# EAGLE design botboardpro-mini (EAGLE 4.16)
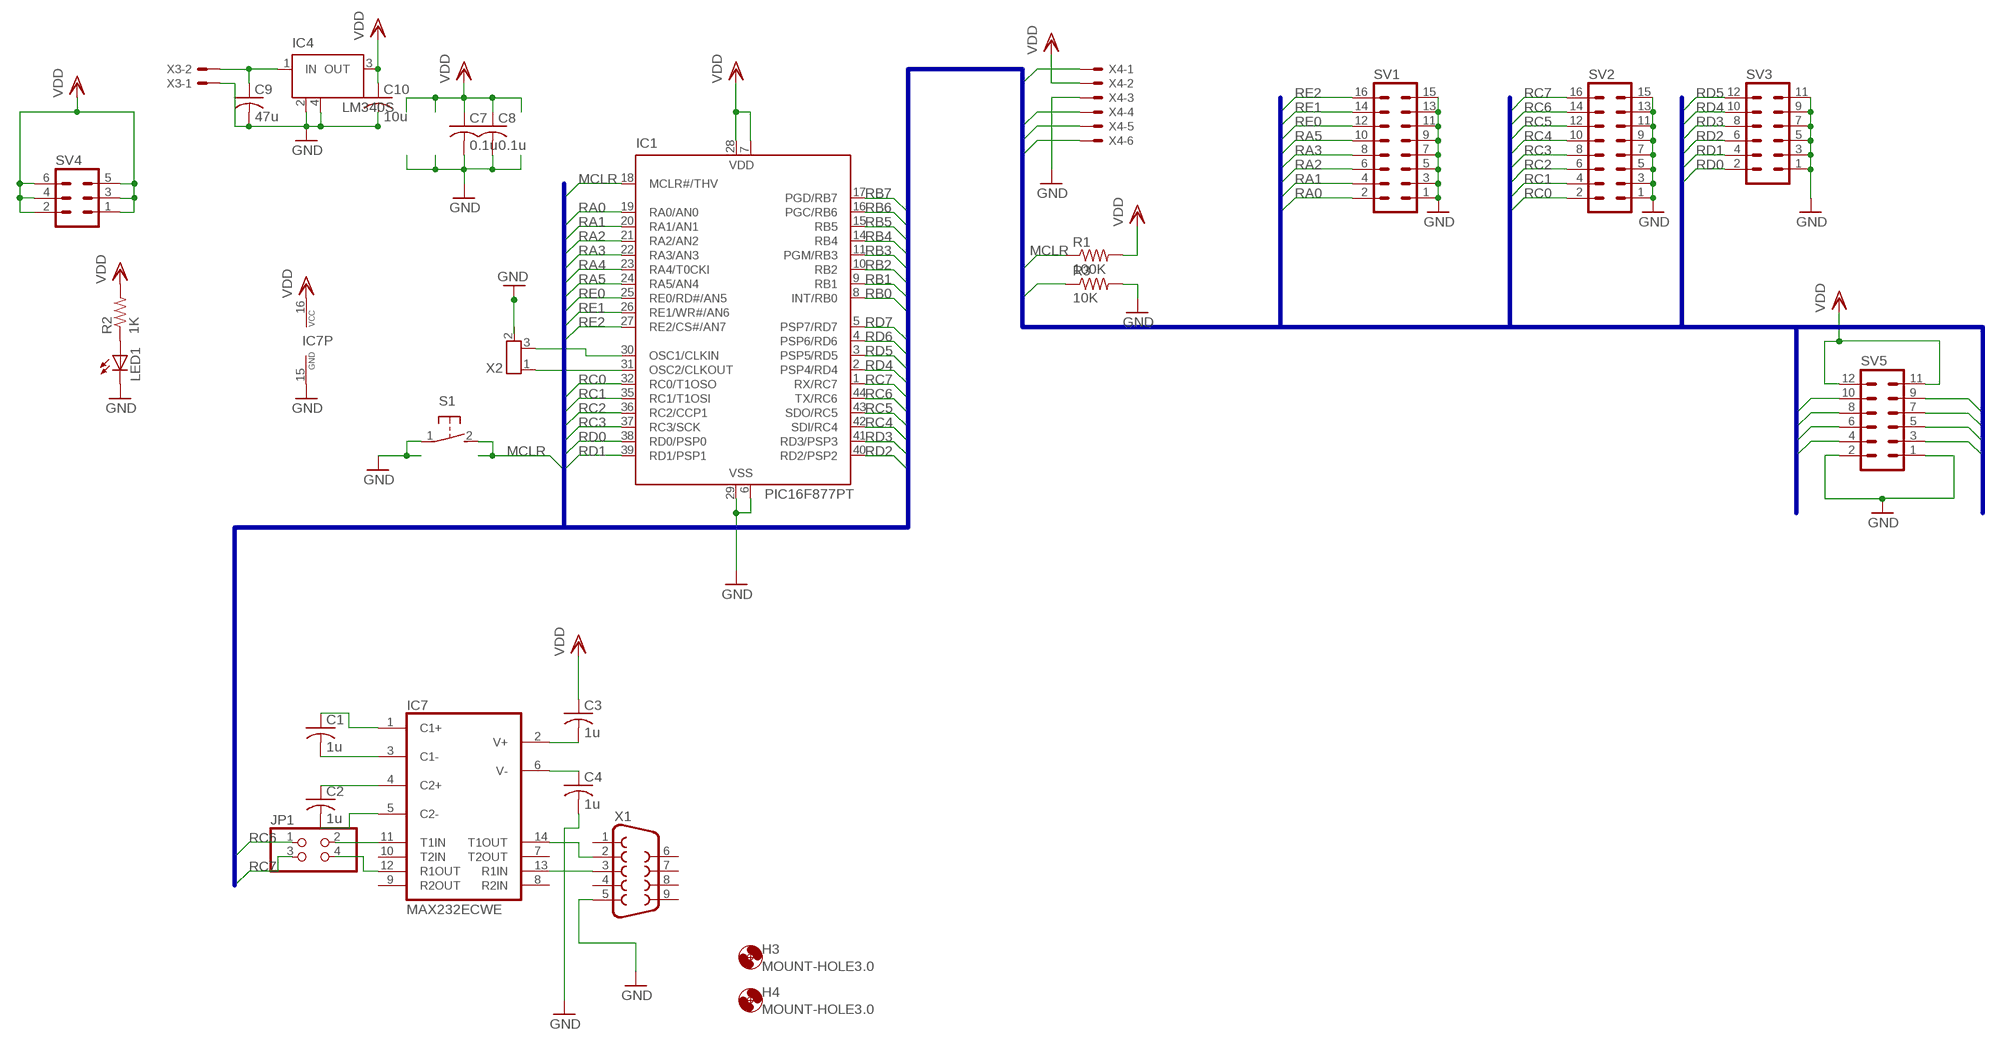
[diagram p0: schematic, sheet 1]

## Parts
C1  1u  C-USC0805  [C0805]
C2  1u  C-USC0805  [C0805]
C3  1u  C-USC0805  [C0805]
C4  1u  C-USC0805  [C0805]
C7  0.1u  C-USC0805  [C0805]
C8  0.1u  C-USC0805  [C0805]
C9  47u  C-USC1206  [C1206]
C10  10u  C-USC1206  [C1206]
H3  MOUNT-HOLE3.0  [3,0]
H4  MOUNT-HOLE3.0  [3,0]
IC1  PIC16F877PT  [TQFP44]
IC4  LM340S  [SOT223]
IC7  MAX232ECWE  [SO16L]
JP1  PINHD-2X2  [2X02]
LED1  LEDCHIPLED_1206  [CHIPLED_1206]
R1  100K  R-US_R0805  [R0805]
R2  1K  R-US_R0805  [R0805]
R3  10K  R-US_R0805  [R0805]
S1  31-XX  [B3F-31XX]
SV1  MA08-2  [MA08-2]
SV2  MA08-2  [MA08-2]
SV3  MA06-2  [MA06-2]
SV4  MA03-2  [MA03-2]
SV5  MA06-2  [MA06-2]
X1  F09D  [F09D]
X2  RESONZTT  [RESONZTT]
X3  22-23-2021  [22-23-2021]
X4  22-23-2061  [22-23-2061]

## Nets
GND: C4.2 C7.2 C8.2 C9.2 C10.2 IC1.6(VSS) IC1.29(VSS) IC4.2(GND) IC4.4(GND) IC7.15(GND) LED1.C R3.2 S1.1(P) SV1.1 SV1.3 SV1.5 SV1.7 SV1.9 SV1.11 SV1.13 SV1.15 SV2.1 SV2.3 SV2.5 SV2.7 SV2.9 SV2.11 SV2.13 SV2.15 SV3.1 SV3.3 SV3.5 SV3.7 SV3.9 SV3.11 SV5.1 SV5.2 X1.5 X3.1 X4.3
MCLR: IC1.18(MCLR#/THV) R1.1 S1.2(S) X4.1
N$1: C9.1 IC4.1(IN) X3.2
N$10: IC1.31(OSC2/CLKOUT) X2.1(X1)
N$11: C2.1 IC7.4(C2+)
N$12: C2.2 IC7.5(C2-)
N$13: C1.2 IC7.3(C1-)
N$14: C1.1 IC7.1(C1+)
N$15: C3.2 IC7.2(V+)
N$16: C4.1 IC7.6(V-)
N$17: IC1.30(OSC1/CLKIN) X2.3(X2)
N$18: IC7.14(T1OUT) X1.2
N$19: IC7.13(R1IN) X1.3
N$20: LED1.A R2.1
N$23: IC7.11(T1IN) JP1.2
N$25: IC7.12(R1OUT) JP1.4
RA0: IC1.19(RA0/AN0) SV1.2
RA1: IC1.20(RA1/AN1) SV1.4
RA2: IC1.21(RA2/AN2) SV1.6
RA3: IC1.22(RA3/AN3) SV1.8
RA4: IC1.23(RA4/T0CKI)
RA5: IC1.24(RA5/AN4) SV1.10
RB0: IC1.8(INT/RB0) SV5.10
RB1: IC1.9(RB1) SV5.8
RB2: IC1.10(RB2) SV5.6
RB3: IC1.11(PGM/RB3) R3.1 SV5.4 X4.6
RB4: IC1.14(RB4) SV5.9
RB5: IC1.15(RB5) SV5.7
RB6: IC1.16(PGC/RB6) X4.5
RB7: IC1.17(PGD/RB7) X4.4
RC0: IC1.32(RC0/T1OSO) SV2.2
RC1: IC1.35(RC1/T1OSI) SV2.4
RC2: IC1.36(RC2/CCP1) SV2.6
RC3: IC1.37(RC3/SCK) SV2.8
RC4: IC1.42(SDI/RC4) SV2.10
RC5: IC1.43(SDO/RC5) SV2.12
RC6: IC1.44(TX/RC6) JP1.1 SV2.14
RC7: IC1.1(RX/RC7) JP1.3 SV2.16
RD0: IC1.38(RD0/PSP0) SV3.2
RD1: IC1.39(RD1/PSP1) SV3.4
RD2: IC1.40(RD2/PSP2) SV3.6
RD3: IC1.41(RD3/PSP3) SV3.8
RD4: IC1.2(PSP4/RD4) SV3.10
RD5: IC1.3(PSP5/RD5) SV3.12
RD6: IC1.4(PSP6/RD6) SV5.5
RD7: IC1.5(PSP7/RD7) SV5.3
RE0: IC1.25(RE0/RD#/AN5) SV1.12
RE1: IC1.26(RE1/WR#/AN6) SV1.14
RE2: IC1.27(RE2/CS#/AN7) SV1.16
VDD: C3.1 C7.1 C8.1 C10.1 IC1.7(VDD) IC1.28(VDD) IC4.3(OUT) IC7.16(VCC) R1.2 R2.2 SV4.1 SV4.2 SV4.3 SV4.4 SV4.5 SV4.6 SV5.11 SV5.12 X4.2
Unconnected: IC7.7(T2OUT) IC7.8(R2IN) IC7.9(R2OUT) IC7.10(T2IN) X1.1 X1.4 X1.6 X1.7 X1.8 X1.9

## Buses
RA[0..5],RB[0..7],RC[0..7],RD[0..7],RE[0..2],MCLR

## Power pins joined to a net without a drawn wire
GND: X2.2(GND)

## Library data of the parts
C1-C4 C7-C10 = rcl:C-US: CAPACITOR, American symbol
H3 H4 = holes:MOUNT-HOLE: MOUNTING HOLE with drill center marker
IC1 = microchip:PIC16F87*: MICROCONTROLLER
IC4 = linear:LM340S: 3-Terminal Positive Regulators Source: http://cache.national.com/ds/LM/LM340.pdf
IC7 = maxim:MAX232ECWE: RS232 TRANSEIVER
JP1 = pinhead:PINHD-2X2: PIN HEADER
LED1 = led:LED: LED OSRAM: - CHIPLED LG R971, LG N971, LY N971, LG Q971, LY Q971, LO R971, LY R971 LH N974, LH R974 LS Q976, LO Q976, LY Q976 LO Q996 - Hyper CHIPLED LW Q18S LB Q993, LB Q99A, LB R99A - SideLED LS A670, LO A670, LY A670, LG A670, LP A670 LB A673, LV A673, LT A673, LW A673 LH A674 LY A675 LS A676, LA A676, LO A676, LY A676, LW A676 LS A679, LY A679, LG A679 - Hyper Micro SIDELED® LS Y876, LA Y876, LO Y876, LY Y876 LT Y87S - SmartLED LW L88C, LW L88S LB L89C, LB L89S, LG L890 LS L89K, LO L89K, LY L89K LS L896, LA L896, LO L896, LY L896 - TOPLED LS T670, LO T670, LY T670, LG T670, LP T670 LSG T670, LSP T670, LSY T670, LOP T670, LYG T670 LG T671, LOG T671, LSG T671 LB T673, LV T673, LT T673, LW T673 LH T674 LS T676, LA T676, LO T676, LY T676, LB T676, LH T676, LSB T676, LW T676 LB T67C, LV T67C, LT T67C, LS T67K, LO T67K, LY T67K, LW E67C LS E67B, LA E67B, LO E67B, LY E67B, LB E67C, LV E67C, LT E67C LW T67C LS T679, LY T679, LG T679 LS T770, LO T770, LY T770, LG T770, LP T770 LB T773, LV T773, LT T773, LW T773 LH T774 LS E675, LA E675, LY E675, LS T675 LS T776, LA T776, LO T776, LY T776, LB T776 LHGB T686 LT T68C, LB T68C - Hyper Mini TOPLED® LB M676 - Mini TOPLED Santana® LG M470 LS M47K, LO M47K, LY M47K Source: http://www.osram.convergy.de/
R1-R3 = rcl:R-US_: RESISTOR, American symbol
S1 = switch-omron:31-XX: OMRON SWITCH
SV1 SV2 = con-lstb:MA08-2: PIN HEADER
SV3 SV5 = con-lstb:MA06-2: PIN HEADER
SV4 = con-lstb:MA03-2: PIN HEADER
X1 = con-subd:F09: SUB-D
X2 = ADS:RESONZTT
X3 = con-molex:22-23-2021: .100" (2.54mm) Center Header - 2 Pin
X4 = con-molex:22-23-2061: .100" (2.54mm) Center Header - 6 Pin

## Board
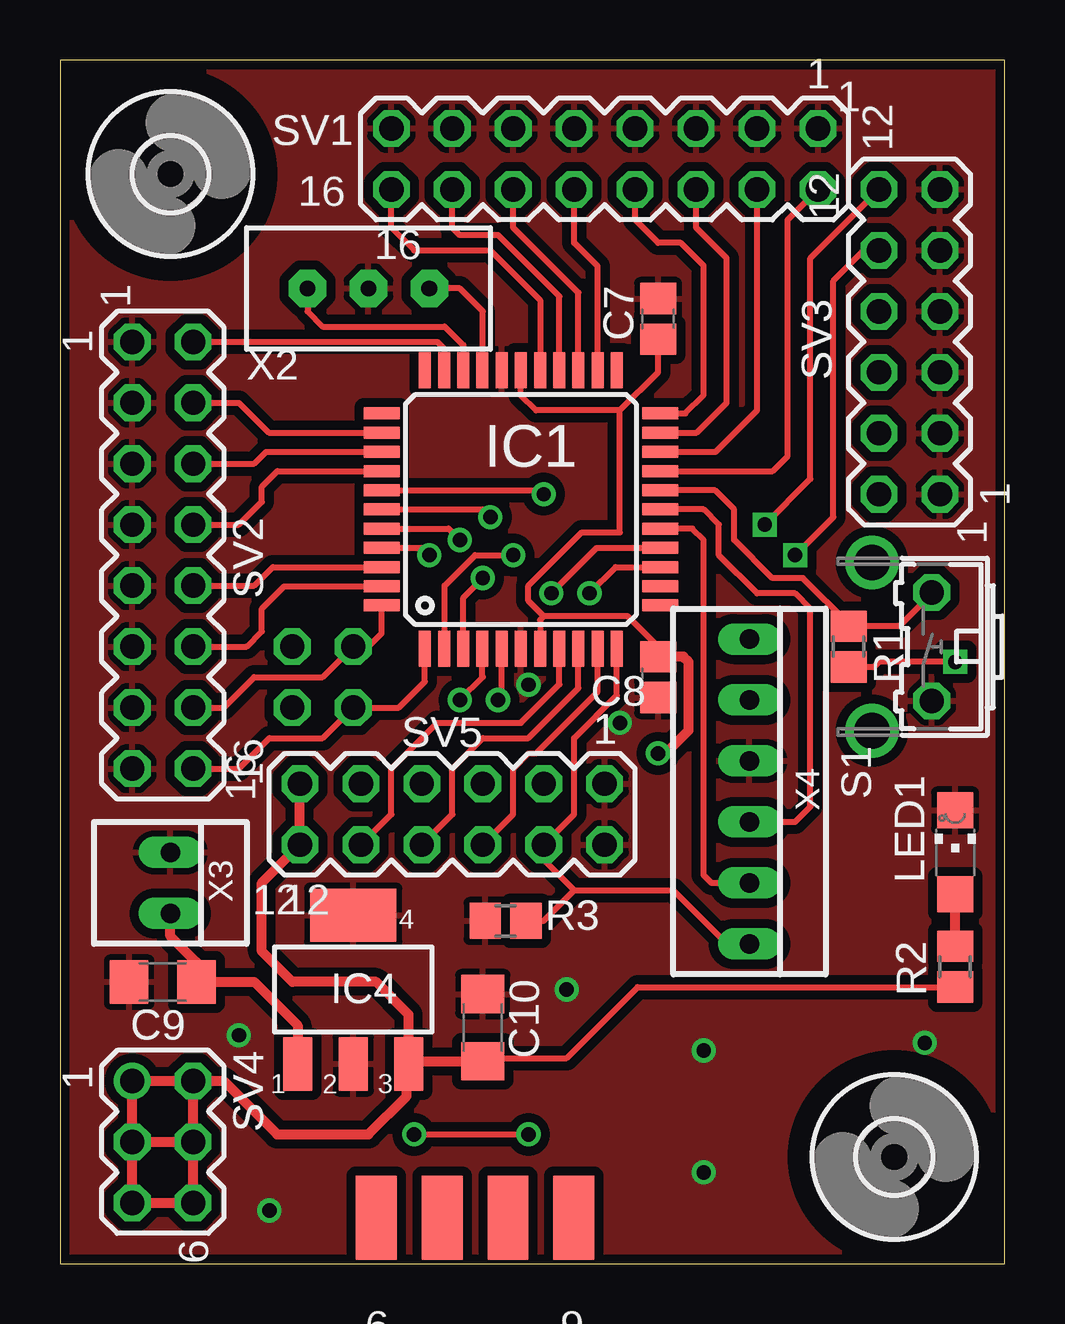
[diagram p1: board, top side]
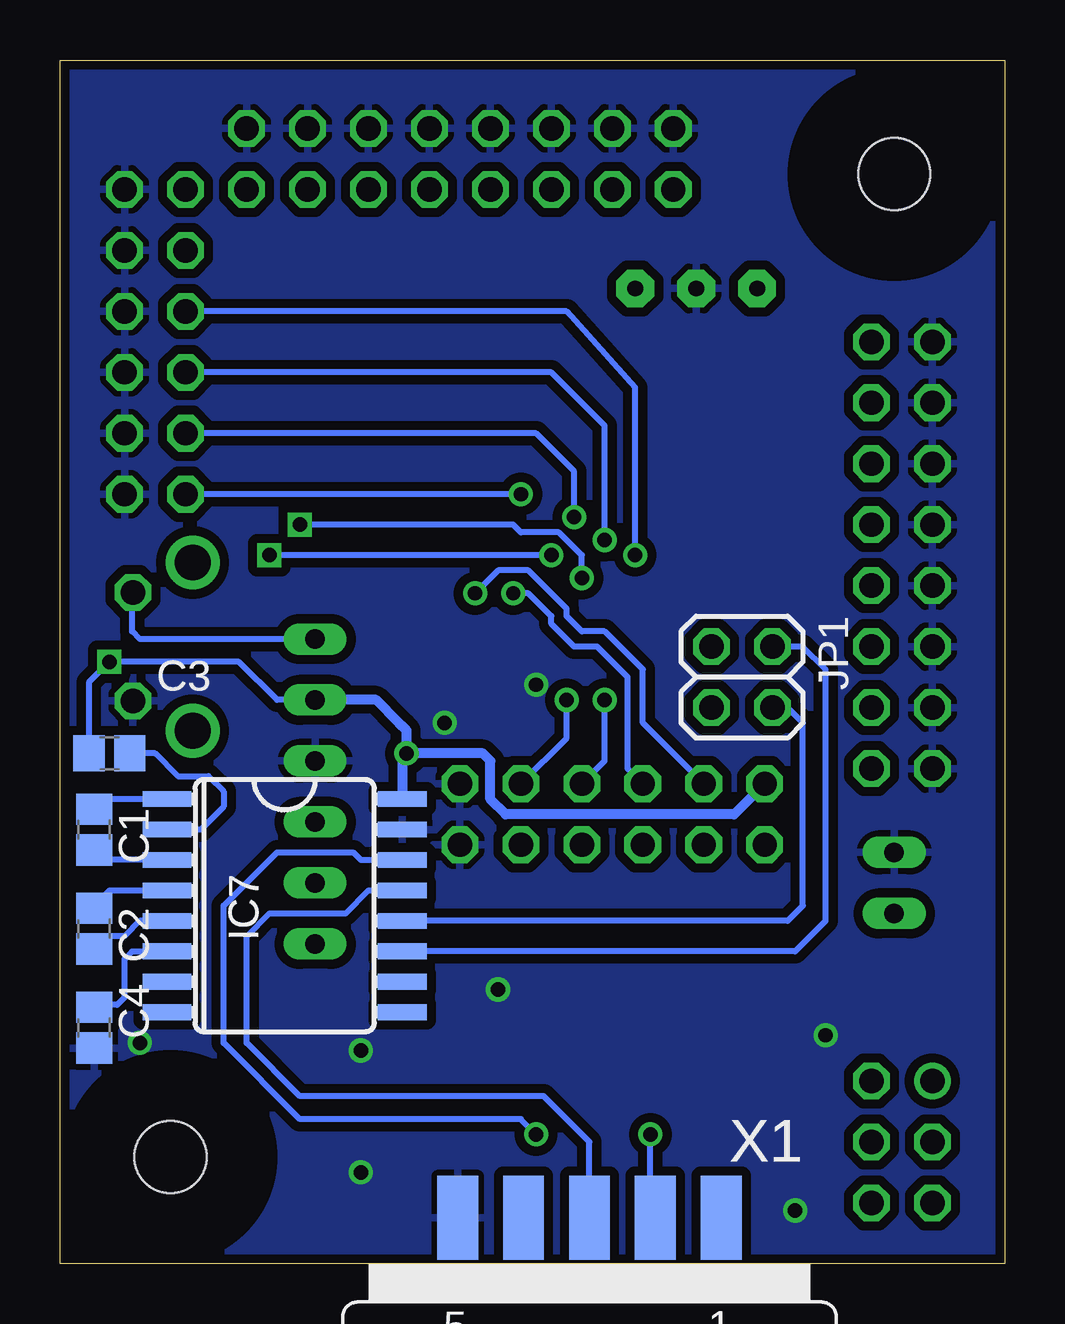
[diagram p2: board, bottom side, seen from below]

Size 39.36 x 50.16 mm. Coordinates in mm from the lower left corner, seen from the top.
Outline: 0,0 39.36,0 39.36,50.15 0,50.15 0,0
Copper layers (1*16): Top 0.035mm / dielectric 1.5mm / Bottom 0.035mm
Design rules "default": minimum track width 4mil, minimum drill 0.6mm, track to track 10mil, track to pad 10mil, pad to pad 10mil, via to via 10mil, smd to smd 10mil, copper to edge 5mil, drill to drill 8mil, minimum pad ring 10mil, minimum via ring 8mil, stop-mask expansion 4mil, vias tented up to drill 0mil, thermal gap 10mil

### Footprints (pad centres in the part's own frame; a part is rotated, then mirrored left to right if it is on the bottom)
C0805 = smd 1.3 x 1.5: 1 -0.85,0; 2 0.85,0
C1206 = smd 1.6 x 1.8: 1 -1.4,0; 2 1.4,0
3,0 = hole 3: 0,0
TQFP44 = smd 1.5 x 0.5: 1 -5.8,4; 2 -5.8,3.2; 3 -5.8,2.4; 4 -5.8,1.6; 5 -5.8,0.8; 6 -5.8,0; 7 -5.8,-0.8; 8 -5.8,-1.6; 9 -5.8,-2.4; 10 -5.8,-3.2; 11 -5.8,-4; 23 5.8,-4; 24 5.8,-3.2; 25 5.8,-2.4; 26 5.8,-1.6; 27 5.8,-0.8; 28 5.8,0; 29 5.8,0.8; 30 5.8,1.6; 31 5.8,2.4; 32 5.8,3.2; 33 5.8,4 | smd 0.5 x 1.5: 12 -4,-5.8; 13 -3.2,-5.8; 14 -2.4,-5.8; 15 -1.6,-5.8; 16 -0.8,-5.8; 17 0,-5.8; 18 0.8,-5.8; 19 1.6,-5.8; 20 2.4,-5.8; 21 3.2,-5.8; 22 4,-5.8; 34 4,5.8; 35 3.2,5.8; 36 2.4,5.8; 37 1.6,5.8; 38 0.8,5.8; 39 0,5.8; 40 -0.8,5.8; 41 -1.6,5.8; 42 -2.4,5.8; 43 -3.2,5.8; 44 -4,5.8
SOT223 = smd 1.219 x 2.235: 1 -2.311,-3.099; 2 0,-3.099; 3 2.311,-3.099 | smd 3.6 x 2.2: 4 0,3.099
SO16L = smd 0.66 x 2.032: 1 -4.445,-4.902; 2 -3.175,-4.902; 3 -1.905,-4.902; 4 -0.635,-4.902; 5 0.635,-4.902; 6 1.905,-4.902; 7 3.175,-4.902; 8 4.445,-4.902; 9 4.445,4.902; 10 3.175,4.902; 11 1.905,4.902; 12 0.635,4.902; 13 -0.635,4.902; 14 -1.905,4.902; 15 -3.175,4.902; 16 -4.445,4.902
2X02 = drill 1.016 octagon: 1 -1.27,-1.27; 2 -1.27,1.27; 3 1.27,-1.27; 4 1.27,1.27
CHIPLED_1206 = smd 1.5 x 1.5: A 0,-1.75; C 0,1.75
R0805 = smd 1.3 x 1.5: 1 -0.85,0; 2 0.85,0
B3F-31XX = drill 1.016 octagon: 1 -2.261,-1.245; 2 2.261,-1.245 | drill 1.499 pad 2.159 round: 3 -3.505,1.245; 4 3.505,1.245
MA08-2 = drill 1.016 octagon: 1 -8.89,-1.27; 2 -8.89,1.27; 3 -6.35,-1.27; 4 -6.35,1.27; 5 -3.81,-1.27; 6 -3.81,1.27; 7 -1.27,-1.27; 8 -1.27,1.27; 9 1.27,-1.27; 10 1.27,1.27; 11 3.81,-1.27; 12 3.81,1.27; 13 6.35,-1.27; 14 6.35,1.27; 15 8.89,-1.27; 16 8.89,1.27
MA06-2 = drill 1.016 octagon: 1 -6.35,-1.27; 2 -6.35,1.27; 3 -3.81,-1.27; 4 -3.81,1.27; 5 -1.27,-1.27; 6 -1.27,1.27; 7 1.27,-1.27; 8 1.27,1.27; 9 3.81,-1.27; 10 3.81,1.27; 11 6.35,-1.27; 12 6.35,1.27
MA03-2 = drill 1.016 round: 1 -2.54,-1.27 | drill 1.016 octagon: 2 -2.54,1.27; 3 0,-1.27; 4 0,1.27; 5 2.54,-1.27; 6 2.54,1.27
F09D = smd 1.7 x 3.5: 1 -5.486,-6.045; 2 -2.743,-6.045; 3 0,-6.045; 4 2.743,-6.045; 5 5.486,-6.045 | smd 1.7 x 3.5 bottom: 6 -4.115,-6.045; 7 -1.372,-6.045; 8 1.372,-6.045; 9 4.115,-6.045
RESONZTT = drill 0.66 pad 1.575 octagon: 1 0,0; 2 2.54,0; 3 5.08,0
22-23-2021 = drill 0.813 long: 1 -1.27,0; 2 1.27,0
22-23-2061 = drill 0.813 long: 1 -6.35,0; 2 -3.81,0; 3 -1.27,0; 4 1.27,0; 5 3.81,0; 6 6.35,0

### Placement (x,y rotation side)
C1  37.94,18.09 270 bottom
C2  37.94,13.96 270 bottom
C3  37.3,21.27 0 bottom
C4  37.94,9.84 270 bottom
C7  24.92,39.36 90 top
C8  24.92,24.44 270 top
C9  4.28,11.74 180 top
C10  17.61,9.84 90 top
H3  34.76,4.44 0 top
H4  4.6,45.4 0 top
IC1  19.2,31.43 90 top
IC4  12.22,11.43 0 top
IC7  30,14.92 270 bottom
JP1  10.95,24.44 270 bottom
LED1  37.3,17.14 0 top
R1  32.86,25.71 270 top
R2  37.3,12.38 270 top
R3  18.57,14.28 180 top
S1  35.08,25.71 90 top
SV1  22.7,46.03 180 top
SV2  4.28,29.52 270 top
SV3  35.4,38.41 90 top
SV4  4.28,5.07 270 top
SV5  16.34,18.73 180 top
X1  17.3,-4.13 180 bottom
X2  10.31,40.64 0 top
X3  4.6,15.87 270 top
X4  28.73,19.68 270 top

### Tracks (layer width: path | path; a pad name or v marks a point on that pad's centre or on a via)
GND  (via drill 0.6)
  other vias: 26.82,3.8 21.11,11.43 26.82,8.89 7.46,9.52 8.72,2.22 23.33,22.54 19.52,24.12 36.03,9.2
  pour Bottom (isolate 0.381): -2.07,52.06 -2.07,-0.96 40.48,-0.96 40.48,52.06
  pour Top (isolate 0.381): -1.44,51.75 40.16,51.75 40.16,-0.96 -1.44,-0.96
MCLR
  Top 0.254: S1.2 36.32,27.96 36.35,27.93 34.98,26.56 R1.1 32.86,26.67 30.95,28.57 29.68,28.57 28.09,30.16 28.09,31.43 27.29,32.23 IC1.18
  Bottom 0.254: S1.2 36.32,27.96 36.35,27.93 36.35,26.35 36.03,26.03 X4.1
N$1
  Top 0.406: C9.1 5.68,12.57 4.6,13.65 X3.2 | IC4.1 9.91,9.93 8.09,11.74 C9.1 | C9.1 5.55,11.74
N$10
  Top 0.254: IC1.31 16.8,38.27 16.03,39.05 10.95,39.05 10.31,39.68 X2.1
N$11
  Bottom 0.254: C2.1 37.94,14.92 37.3,15.55 IC7.4
N$12
  Bottom 0.254: IC7.5 36.03,14.28 36.67,13.65 37.3,13.65 37.94,13.01 C2.2
N$13
  Bottom 0.254: C1.2 37.94,17.14 37.62,16.82 IC7.3
N$14
  Bottom 0.254: C1.1 37.94,18.73 37.3,19.36 IC7.1
N$15
  Bottom 0.254: IC7.2 33.49,18.09 32.54,19.04 32.54,19.68 33.17,20.32 34.44,20.32 35.4,21.27 C3.2
N$16
  Bottom 0.254: IC7.6 36.35,13.01 36.67,12.7 36.67,11.11 36.98,10.79 37.94,10.79 C4.1
N$17
  Top 0.254: X2.3 16.66,40.64 17.61,39.68 17.61,37.46 17.6,37.45 IC1.30
N$18  (via drill 0.6)
  Top 0.254: v14.76,5.39 v19.52,5.39
  Bottom 0.254: IC7.14 26.82,16.82 27.14,17.14 30.31,17.14 32.54,14.92 32.54,9.2 29.36,6.03 20.15,6.03 v19.52,5.39 | X1.2 14.55,1.79 14.44,1.9 14.76,2.22 v14.76,5.39
N$19
  Bottom 0.254: X1.3 17.3,5.07 19.2,6.98 29.36,6.98 31.58,9.2 31.58,13.65 30.63,14.6 27.46,14.6 26.5,15.55 IC7.13 24.92,15.55
N$20
  Top 0.406: 37.3,13.01 R2.1 LED1.A
N$23
  Bottom 0.254: JP1.2 8.41,25.71 7.46,24.76 7.46,14.28 8.72,13.01 IC7.11 25.23,13.01
N$25
  Bottom 0.254: IC7.12 9.04,14.28 8.41,14.92 8.41,22.54 9.04,23.17 JP1.4
RA0
  Top 0.254: IC1.19 29.69,33.03 30.31,33.65 30.31,43.49 SV1.2
RA1
  Top 0.254: IC1.20 27.32,33.83 29.04,35.56 SV1.4
RA2
  Top 0.254: IC1.21 26.53,34.63 27.77,35.87 27.77,41.9 26.5,43.18 SV1.6
RA3
  Top 0.254: IC1.22 26.06,35.43 26.82,36.19 26.82,41.59 25.87,42.54 24.92,42.54 23.96,43.49 SV1.8
RA5
  Top 0.254: IC1.24 22.4,41.56 21.43,42.54 SV1.10
RB0
  Top 0.254: IC1.8 20.8,24.14 19.2,22.54 15.71,22.54 13.8,20.63 13.8,18.73 SV5.10
RB1
  Top 0.254: IC1.9 21.6,23.99 19.52,21.9 17.61,21.9 16.34,20.63 16.34,18.73 SV5.8
RB2
  Top 0.254: IC1.10 22.4,23.83 19.84,21.27 19.52,21.27 18.88,20.63 18.88,18.73 SV5.6
RB3
  Top 0.254: IC1.11 23.2,23.68 21.43,21.9 21.43,18.73 SV5.4 20.15,16.82 21.43,15.55 | X4.6 27.77,13.33 25.55,15.55 21.43,15.55 | R3.1 20.15,14.28 21.43,15.55
RB4  (via drill 0.6)
  Top 0.254: IC1.14 23.15,29.03 v22.06,27.93
  Bottom 0.254: v22.06,27.93 21.11,28.89 19.84,28.89 18.25,27.3 18.25,26.98 17.61,26.35 16.66,26.35 15.07,24.76 15.07,22.54 SV5.9
RB5  (via drill 0.6)
  Top 0.254: IC1.15 22.36,29.83 v20.47,27.93
  Bottom 0.254: v20.47,27.93 19.84,27.93 18.88,26.98 18.88,26.67 17.93,25.71 16.98,25.71 15.71,24.44 15.71,20.63 SV5.7
RB6
  Top 0.254: IC1.16 26.35,30.63 26.82,30.16 26.82,16.19 27.14,15.87 X4.5
RB7
  Top 0.254: IC1.17 26.82,31.43 27.46,30.79 27.46,29.52 29.04,27.93 30.63,27.93 31.27,27.3 31.27,19.04 30.63,18.41 X4.4
RC0
  Top 0.254: 5.23,38.41 SV2.2 15.71,38.41 16,38.12 IC1.32
RC1
  Top 0.254: IC1.35 8.7,34.63 7.46,35.87 SV2.4
RC2
  Top 0.254: IC1.36 8.58,33.83 8.09,33.33 SV2.6
RC3
  Top 0.254: IC1.37 9.05,33.03 8.41,32.38 8.41,31.75 7.46,30.79 SV2.8
RC4
  Top 0.254: IC1.42 8.86,29.03 8.09,28.25 SV2.10
RC5
  Top 0.254: IC1.43 9.33,28.23 8.41,27.3 8.41,26.35 7.77,25.71 SV2.12
RC6
  Top 0.254: IC1.44 13.4,26.26 12.85,25.71 JP1.1 10.95,24.44 8.09,24.44 6.82,23.17 SV2.14
RC7
  Top 0.254: IC1.1 15.2,24.25 14.12,23.17 JP1.3 10.95,21.9 8.72,21.9 7.46,20.63 SV2.16
RD0  (via drill 0.6)
  Top 0.254: IC1.38 19.99,32.23 v20.15,32.06
  Bottom 0.254: v20.15,32.06 SV3.2
RD1  (via drill 0.6)
  Top 0.254: IC1.39 17.61,31.43 v17.93,31.11
  Bottom 0.254: v17.93,31.11 17.93,33.01 19.52,34.6 SV3.4
RD2  (via drill 0.6)
  Top 0.254: IC1.40 16.19,30.63 v16.66,30.16
  Bottom 0.254: v16.66,30.16 16.66,34.92 18.88,37.14 SV3.6
RD3  (via drill 0.6)
  Top 0.254: IC1.41 15.06,29.83 v15.39,29.52
  Bottom 0.254: v15.39,29.52 15.39,36.51 18.25,39.68 SV3.8
RD4  (via drill 0.6)
  Top 0.254: SV3.10 33.49,42.22 32.22,40.95 32.22,31.11 v30.63,29.52 | v18.88,29.52 17.3,29.52 16.03,28.25 16.03,25.71 16,25.69 IC1.2
  Bottom 0.254: v18.88,29.52 v30.63,29.52
RD5  (via drill 0.6)
  Top 0.254: v29.36,30.79 31.27,32.7 31.27,41.9 33.81,44.44 33.81,44.76 SV3.12 | IC1.3 16.8,27.76 v17.61,28.57
  Bottom 0.254: v29.36,30.79 20.47,30.79 20.15,30.47 18.57,30.47 17.61,29.52 v17.61,28.57
RD6  (via drill 0.6)
  Top 0.254: IC1.4 17.6,24.46 17.61,24.44 v16.66,23.49
  Bottom 0.254: v16.66,23.49 16.66,20.95 SV5.5
RD7  (via drill 0.6)
  Top 0.254: IC1.5 18.4,23.65 v18.25,23.49
  Bottom 0.254: v18.25,23.49 18.25,21.9 SV5.3
RE0
  Top 0.254: IC1.25 21.6,40.46 18.88,43.18 SV1.12
RE1
  Top 0.254: IC1.26 20.8,40.31 18.25,42.86 16.66,42.86 16.34,43.18 SV1.14
RE2
  Top 0.254: IC1.27 20,40.15 17.93,42.22 14.76,42.22 13.8,43.18 SV1.16
VDD  (via drill 0.6)
  Top 0.254: C8.1 24.92,25.71 23.65,26.98 20.15,26.98 | IC1.7 20,26.83 20.15,26.98 | C7.1 24.92,37.14 23.33,35.56 | 23.33,35.56 19.84,35.56 19.2,36.19 IC1.28 | 23.33,35.56 23.33,30.47 21.74,30.47 19.52,28.25 19.52,27.62 20.15,26.98 | R2.2 24.07,11.53 21.11,8.57 17.93,8.57 17.61,8.25 C10.1 | R1.2 33.91,24.86 34.12,25.08 v37.3,25.08
  Top 0.406: SV4.4 SV4.2 | SV4.2 SV4.1 SV4.3 | SV4.2 5.87,7.3 | SV4.6 SV4.4 | SV4.3 SV4.5 SV4.6 | SV4.6 SV4.4 | SV4.3 SV4.4 | C10.1 14.63,8.44 14.52,8.33 | SV5.11 SV5.12 8.41,15.87 8.41,13.01 9.68,11.74 13.17,11.74 14.53,10.38 IC4.3 14.52,8.33 | C8.1 25.97,25.29 26.19,25.08 26.19,22.22 25.23,21.27 v24.92,21.27 | SV4.2 6.82,7.61 9.04,5.39 12.85,5.39 14.44,6.98 14.44,8.25 14.52,8.33
  Bottom 0.254: X4.2 30.31,23.49 31.9,25.08 v37.3,25.08 38.15,24.23 C3.1
  Bottom 0.406: 25.23,22.54 25.09,22.4 | 25.23,22.54 26.19,23.49 X4.2 | IC7.16 25.09,21.09 v24.92,21.27 | v24.92,21.27 24.92,22.22 25.23,22.54 | SV5.11 11.26,18.73 20.79,18.73 21.43,19.36 21.43,20.95 21.74,21.27 v24.92,21.27

### Text on the board
_tsilk: 1 | SV1 | 12 | 16 | 1 | C7 | X2 | SV3 | IC1 | SV2 | 1 | R1 | SV5 | C8 | 1 | 16 | X4 | S1 | X3 | 12 | LED1 | R3 | R2 | IC4 | C9 | SV4 | 1 | C10 | 6
_bsilk: JP1 | C3 | C1 | IC7 | C2 | C4 | X1